# Altium schematic sheet FMC_SFP_ADAPTER_FMC.SchDoc: Connector (LPC), Commercial grade mounting, FMC FRU EEPROM
size A4; Date: 10.03.2021; DrawnBy: PFH; Engineer: PFH; DocumentNumber: 1; Revision: A; SheetNumber: 1; SheetTotal: 2; Projekt: FMC-to-SFP Adapter; Website: www.fmchub.com; ProjectName: FMC_Single_LPC_Commercial
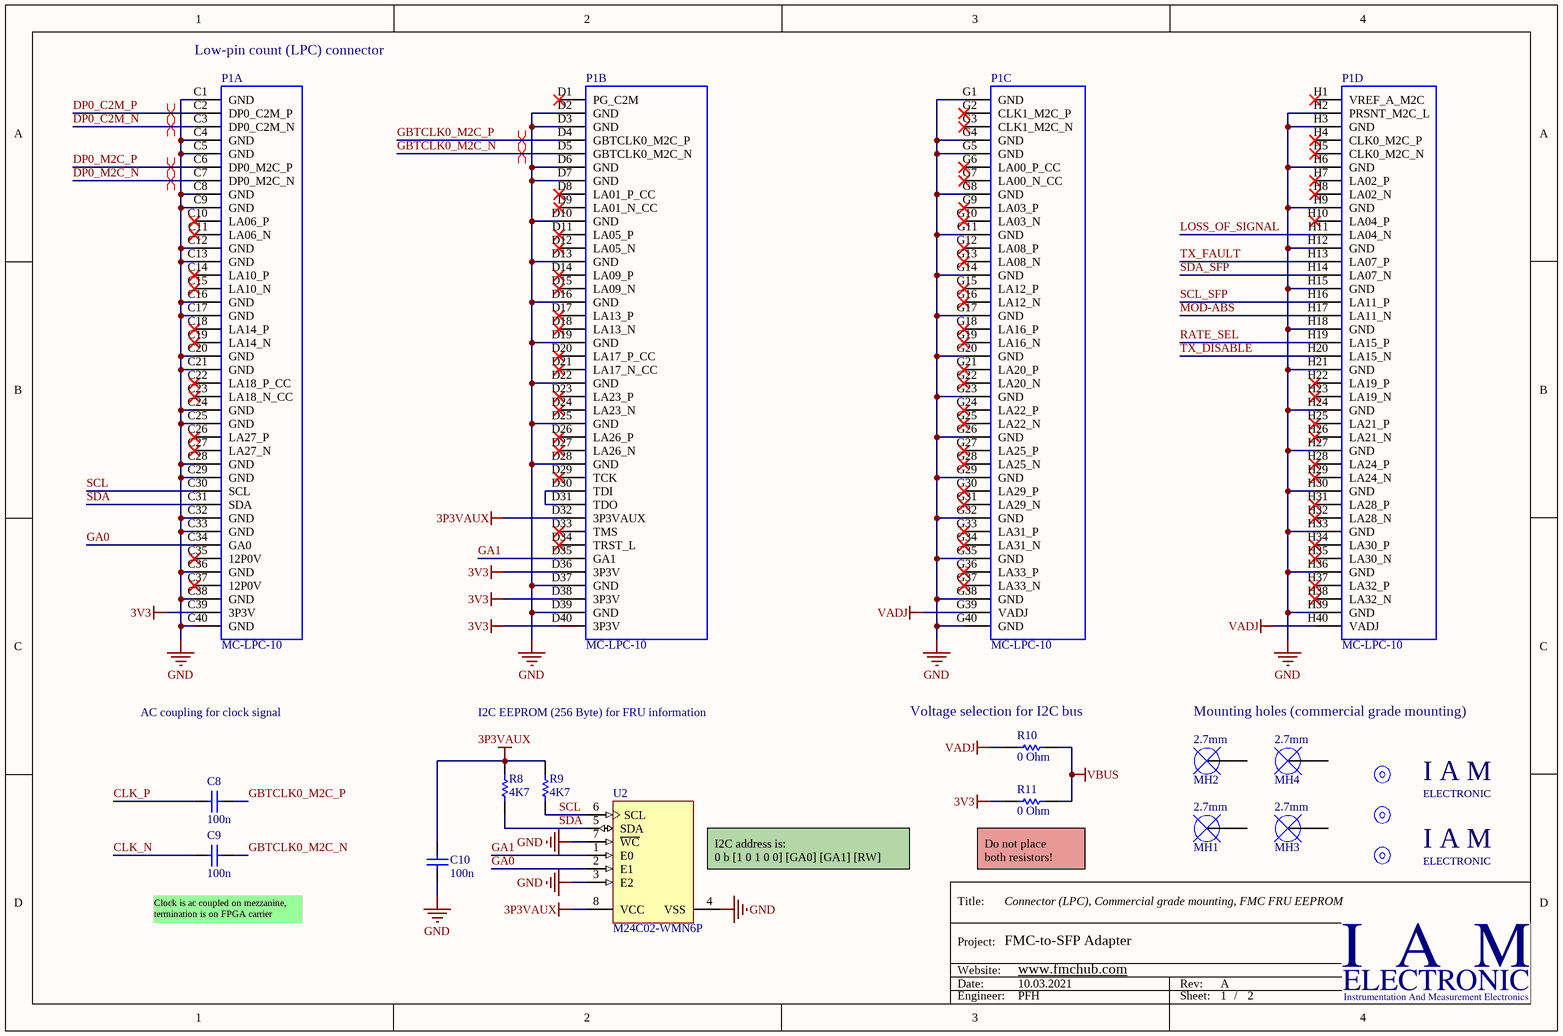
[diagram p0: FMC_SFP_ADAPTER_FMC.SchDoc]

## Parts
C8  100n  [CAPC1005X55X25ML05T10]
C9  100n  [CAPC1005X55X25ML05T10]
C10  100n  [CAPC1005X55X25ML05T10]
FM1  1mm  [FIDUCIAL_MARK_ROUND_RING]  (value not drawn)  (no BOM)
FM2  1mm  [FIDUCIAL_MARK_ROUND_RING]  (value not drawn)  (no BOM)
FM3  1mm  [FIDUCIAL_MARK_ROUND_RING]  (value not drawn)  (no BOM)
MH1  2.7mm  [Mounting_Hole_Plated_2.7mm - d3.1mm]  (no BOM)
MH2  2.7mm  [Mounting_Hole_Plated_2.7mm - d3.1mm]  (no BOM)
MH3  2.7mm  [Mounting_Hole_Plated_2.7mm-COVERED]  (no BOM)
MH4  2.7mm  [Mounting_Hole_Plated_2.7mm-COVERED]  (no BOM)
P1  MC-LPC-10  [ASP-134604-01]  (parts A,B,C,D of 4)
R8  4K7  [RESC1005X40X25ML05T05]
R9  4K7  [RESC1005X40X25ML05T05]
R10  0 Ohm  [RESC3116X65X40LL10T20]
R11  0 Ohm  [RESC3116X65X40LL10T20]  (no BOM)
STR1  IAM LOGO  [IAM LOGO - LARGE - WWW]  (value not drawn)  (no BOM)
STR2  IAM LOGO  [IAM LOGO - LARGE - WWW]  (value not drawn)  (no BOM)
U2  M24C02-WMN6P  [STM-SO-8_D_L]

## Nets
3P3VAUX: C10.2 P1.D32(3P3VAUX) R8.2 R9.2 U2.8(VCC)
3V3: P1.C39(3P3V) P1.D36(3P3V) P1.D38(3P3V) P1.D40(3P3V) R11.1
GND: C10.1 P1.C1(GND) P1.C4(GND) P1.C5(GND) P1.C8(GND) P1.C9(GND) P1.C12(GND) P1.C13(GND) P1.C16(GND) P1.C17(GND) P1.C20(GND) P1.C21(GND) P1.C24(GND) P1.C25(GND) P1.C28(GND) P1.C29(GND) P1.C32(GND) P1.C33(GND) P1.C36(GND) P1.C38(GND) P1.C40(GND) P1.D2(GND) P1.D3(GND) P1.D6(GND) P1.D7(GND) P1.D10(GND) P1.D13(GND) P1.D16(GND) P1.D19(GND) P1.D22(GND) P1.D25(GND) P1.D28(GND) P1.D37(GND) P1.D39(GND) P1.G1(GND) P1.G4(GND) P1.G5(GND) P1.G8(GND) P1.G11(GND) P1.G14(GND) P1.G17(GND) P1.G20(GND) P1.G23(GND) P1.G26(GND) P1.G29(GND) P1.G32(GND) P1.G35(GND) P1.G38(GND) P1.G40(GND) P1.H2(PRSNT_M2C_L) P1.H3(GND) P1.H6(GND) P1.H9(GND) P1.H12(GND) P1.H15(GND) P1.H18(GND) P1.H21(GND) P1.H24(GND) P1.H27(GND) P1.H30(GND) P1.H33(GND) P1.H36(GND) P1.H39(GND) U2.3(E2) U2.4(VSS) U2.7(~{WC})
VADJ: P1.G39(VADJ) P1.H40(VADJ) R10.1
VBUS: R10.2 R11.2
CLK_N: C9.2
CLK_P: C8.2
DP0_C2M_N: P1.C3(DP0_C2M_N)
DP0_C2M_P: P1.C2(DP0_C2M_P)
DP0_M2C_N: P1.C7(DP0_M2C_N)
DP0_M2C_P: P1.C6(DP0_M2C_P)
GA0: P1.C34(GA0) U2.2(E1)
GA1: P1.D35(GA1) U2.1(E0)
GBTCLK0_M2C_N: C9.1 P1.D5(GBTCLK0_M2C_N)
GBTCLK0_M2C_P: C8.1 P1.D4(GBTCLK0_M2C_P)
LOSS_OF_SIGNAL: P1.H11(LA04_N)
MOD-ABS: P1.H17(LA11_N)
RATE_SEL: P1.H19(LA15_P)
SCL: P1.C30(SCL) R9.1 U2.6(SCL)
SCL_SFP: P1.H16(LA11_P)
SDA: P1.C31(SDA) R8.1 U2.5(SDA)
SDA_SFP: P1.H14(LA07_N)
TX_DISABLE: P1.H20(LA15_N)
TX_FAULT: P1.H13(LA07_P)
NetP1_D30: P1.D30(TDI) P1.D31(TDO)

Not connected (* = marked no-connect by the designer): FM1 FD0; FM2 FD0; FM3 FD0; MH1 0; MH2 0; MH3 0; MH4 0; P1 C10(LA06_P)* C11(LA06_N)* C14(LA10_P)* C15(LA10_N)* C18(LA14_P)* C19(LA14_N)* C22(LA18_P_CC)* C23(LA18_N_CC)* C26(LA27_P)* C27(LA27_N)* C35(12P0V)* C37(12P0V)* D1(PG_C2M)* D8(LA01_P_CC)* D9(LA01_N_CC)* D11(LA05_P)* D12(LA05_N)* D14(LA09_P)* D15(LA09_N)* D17(LA13_P)* D18(LA13_N)* D20(LA17_P_CC)* D21(LA17_N_CC)* D23(LA23_P)* D24(LA23_N)* D26(LA26_P)* D27(LA26_N)* D29(TCK)* D33(TMS)* D34(TRST_L)* G2(CLK1_M2C_P)* G3(CLK1_M2C_N)* G6(LA00_P_CC)* G7(LA00_N_CC)* G9(LA03_P)* G10(LA03_N)* G12(LA08_P)* G13(LA08_N)* G15(LA12_P)* G16(LA12_N)* G18(LA16_P)* G19(LA16_N)* G21(LA20_P)* G22(LA20_N)* G24(LA22_P)* G25(LA22_N)* G27(LA25_P)* G28(LA25_N)* G30(LA29_P)* G31(LA29_N)* G33(LA31_P)* G34(LA31_N)* G36(LA33_P)* G37(LA33_N)* H1(VREF_A_M2C)* H4(CLK0_M2C_P)* H5(CLK0_M2C_N)* H7(LA02_P)* H8(LA02_N)* H10(LA04_P)* H22(LA19_P)* H23(LA19_N)* H25(LA21_P)* H26(LA21_N)* H28(LA24_P)* H29(LA24_N)* H31(LA28_P)* H32(LA28_N)* H34(LA30_P)* H35(LA30_N)* H37(LA32_P)* H38(LA32_N)*

## Layout directives
differential pair: DP0_C2M_N, DP0_C2M_P, DP0_M2C_N, DP0_M2C_P, GBTCLK0_M2C_N, GBTCLK0_M2C_P

## Notes on the sheet
- (near P1) Low-pin count (LPC) connector
- AC coupling for clock signal
- I2C EEPROM (256 Byte) for FRU information
- (near R10) Voltage selection for I2C bus
- Mounting holes (commercial grade mounting)
- (near C9) Clock is ac coupled on mezzanine,
  termination is on FPGA carrier
- (near U2) I2C address is:
  0 b [1 0 1 0 0] [GA0] [GA1] [RW]
- (near R11) Do not place
  both resistors!
- Title:
- Project:
- Date:
- Website:
- Rev:
- Engineer:
- Sheet:
- /
- (in symbol IAM_LOGO) I A M; ELECTRONIC

## Library data of the parts
C8-C10 = CMP-2100-03641-1: Chip Capacitor, 0.1 uF, +/- 10%, 16 V, -55 to 125 degC, 0402 (1005 Metric), RoHS, Tape and Reel; Manufacturer: Murata; Part: GRM155R71C104KA88D; Material: Ceramic; Insulation Resistance: 10GR; Voltage: 16V; Dielectric: X7R; Capacitance: 100nF; REACH SVHC: NoSVHC; Depth: 0.5mm; Case/Package: 0402; Datasheet URL: http://psearch.en.murata.com/capacitor/product/GRM155R71C104KA88%23.pdf; Lead Free: LeadFree; Dielectric Material: Ceramic; Manufacturer URL: http://www.murata.com/; Min Operating Temperature: -55degC; Length: 1mm; Case Code (Metric): 1005; Radiation Hardening: No; Package Reference: 0402; RoHSCompliant: true; Datasheet Version: 42675.0; Thickness: 0.022inch; Packaging: TapeandReel; Voltage Rating (DC): 16V; Tolerance: 10%; Max Operating Temperature: 125degC; Package Description: 2-Pin Surface Mount Device, Body 1 x 0.5 mm; Mount: SurfaceMount; Height: 0.5mm; Width: 0.5mm; Number of Pins: 2; Voltage Rating: 16V; Case Code (Imperial): 0402; Termination: SMD/SMT; Package Quantity: 1
FM1-FM3 = Fiducial_Mark: Fiducial mark, width 1mm, clearance 3mm; Width: 1 mm; Clearance: 3 mm
MH1-MH4 = Mounting_Hole_2.7mm: Mounting hole, hole size 2.7mm; Hole radius: 2.7 mm; Diameter (plated): *; Keep out (radius): *; Plated: *
P1 = MC-LPC-10: MC-LPC-10, FMC Low-pin count connector, lead free, 160 I/Os, male, 10 mm mated stack height; Manufacturer: Samtec; Manufacturer Ref: SEAM-40-03.5-S-10-2-A-K-TR-VITA57; Pitch: 1.27 mm; Mated Stack Height: 10 mm; Solder Type: Lead-Free; Number I/O: 160; PartName: ASP-134604-01; Part: ASP-134604-01; Vita PartNumber: MC-LPC-10; Pin Count: Low; Gender: male; Supplier 1: Digi-Key; Supplier Part Number 1: SAM8732-ND
R8 R9 = CMP-2002-00051-2: Chip Resistor, 4.7 KOhm, +/- 1%, 63 mW, -55 to 155 degC, 0402 (1005 Metric), RoHS, Tape and Reel; PartNumber: CRCW04024K70FKED; Manufacturer: Vishay; Power Rating: 63 mW; Voltage Rating: 50 V; Length: 1 mm; Mount: Surface Mount; Case Code (Metric): 1005; ComponentLink1Description: Datasheet; Package Quantity: 10000; Case Code (Imperial): 0402; Max Operating Temperature: 155 degC; Case/Package: 0402; REACH SVHC: Unknown; PackageDescription: 2-Pin Surface Mount Device, Body 1 x 0.5 mm; Width: 0.5 mm; Min Operating Temperature: -55 degC; Resistance: 4.7 KOhm; Height: 0.35 mm; Packaging: Tape and Reel; Mounting Technology: Surface Mount; Tolerance: 1%; RoHSCompliant: True; ComponentLink1URL: http://www.vishay.com/docs/20035/dcrcwe3.pdf; Part: CRCW04024K70FKED
R10 R11 = CMP-2100-03681-1: Chip Resistor, 0 Ohm, +/- 5%, -55 to 155 degC, 1206 (3216 Metric), RoHS, Tape and Reel; Manufacturer: Yageo; Part: RC1206JR-070RL; Max Power Dissipation: 250mW; Resistance: 0mOhm; Voltage Rating: 200V; Temperature Coefficient: 200ppm/degreesC; Case Code (Imperial): 1206; Lead Free: LeadFree; Package Quantity: 5000; Radiation Hardening: No; Tolerance: 5%; Length: 3.1mm; Termination: SMD/SMT; Contact Plating: Tin; Military Standard: Not; Manufacturer URL: http://www.yageo.com/; Datasheet URL: http://www.yageo.com/documents/recent/PYu-RC_Group_51_RoHS_L_5.pdf; Height: 0.026inch; RoHSCompliant: true; Min Operating Temperature: -55degC; REACH SVHC: Unknown; Max Operating Temperature: 155degC; Depth: 1.6mm; Packaging: TapeandReel; Package Reference: 1206.0; Number of Terminations: 2; Case/Package: 1206; Composition: CarbonFilm; Case Code (Metric): 3216; Datasheet Version: Rev. 5, 10/2016; Power Rating: 250mW; Package Description: 2-Pin Surface Mount Device, Body 3.1 x 1.6 mm; Width: 0.063inch
STR1 STR2 = IAM_LOGO: I A M E L E C T R O N I C - Logo; Layer: Top Overlay; Manufacturer: IAM ELECTRONIC; Part: Logo
U2 = CMP-2000-06638-1: 2-Kbit Serial I2C Bus EEPROM, 2.5 to 5.5 V, -40 to 85 degC, 8-Pin SOIC, RoHS, Tube; Manufacturer: STMicroelectronics; Programming Voltage: 2.5 / V; Interface Type: Serial-I2C; Number of Words: 256; Maximum Random Access Time: 100 / ns; Data Retention: <specialid="6"/>specialid="80"/>200 / yr; Number of Bits per Word: 8 / bit; Memory Size: 2 / kbit; Maximum Operating Supply Voltage: 5.5 / V; Organisation: 256x8; Operating Temperature Range: -40to+85 / °C; Dimensions: 5.000x4.000x1.500 / mm; Height: 1.5 / mm; Operating Supply Voltage Range: 2.5to5.5 / V; Package Type: SO; Manufacturer URL: http://www.st.com/; Package Reference: SO-8; Mounting Technology: SurfaceMount; Package Description: 8-Pin Small Outline Integrated Circuit, Body 4.9 x 3.9 mm, Pitch 1.27 mm; Maximum Operating Temperature: +85 / °C; Datasheet Version: Rev. 2, 09/2013; Minimum Operating Temperature: -40 / °C; Length: 5 / mm; Datasheet URL: http://www.st.com/content/ccc/resource/technical/document/datasheet/b0/d8/50/40/5a/85/49/6f/DM00071904.pdf/files/DM00071904.pdf/jcr:content/translations/en.DM00071904.pdf; Minimum Operating Supply Voltage: 2.5 / V; Mounting Type: SurfaceMount; Pin Count: 8; Width: 4 / mm; Part: M24C02-WMN6P